# EAGLE design out8_16A_bo (EAGLE 5.04)
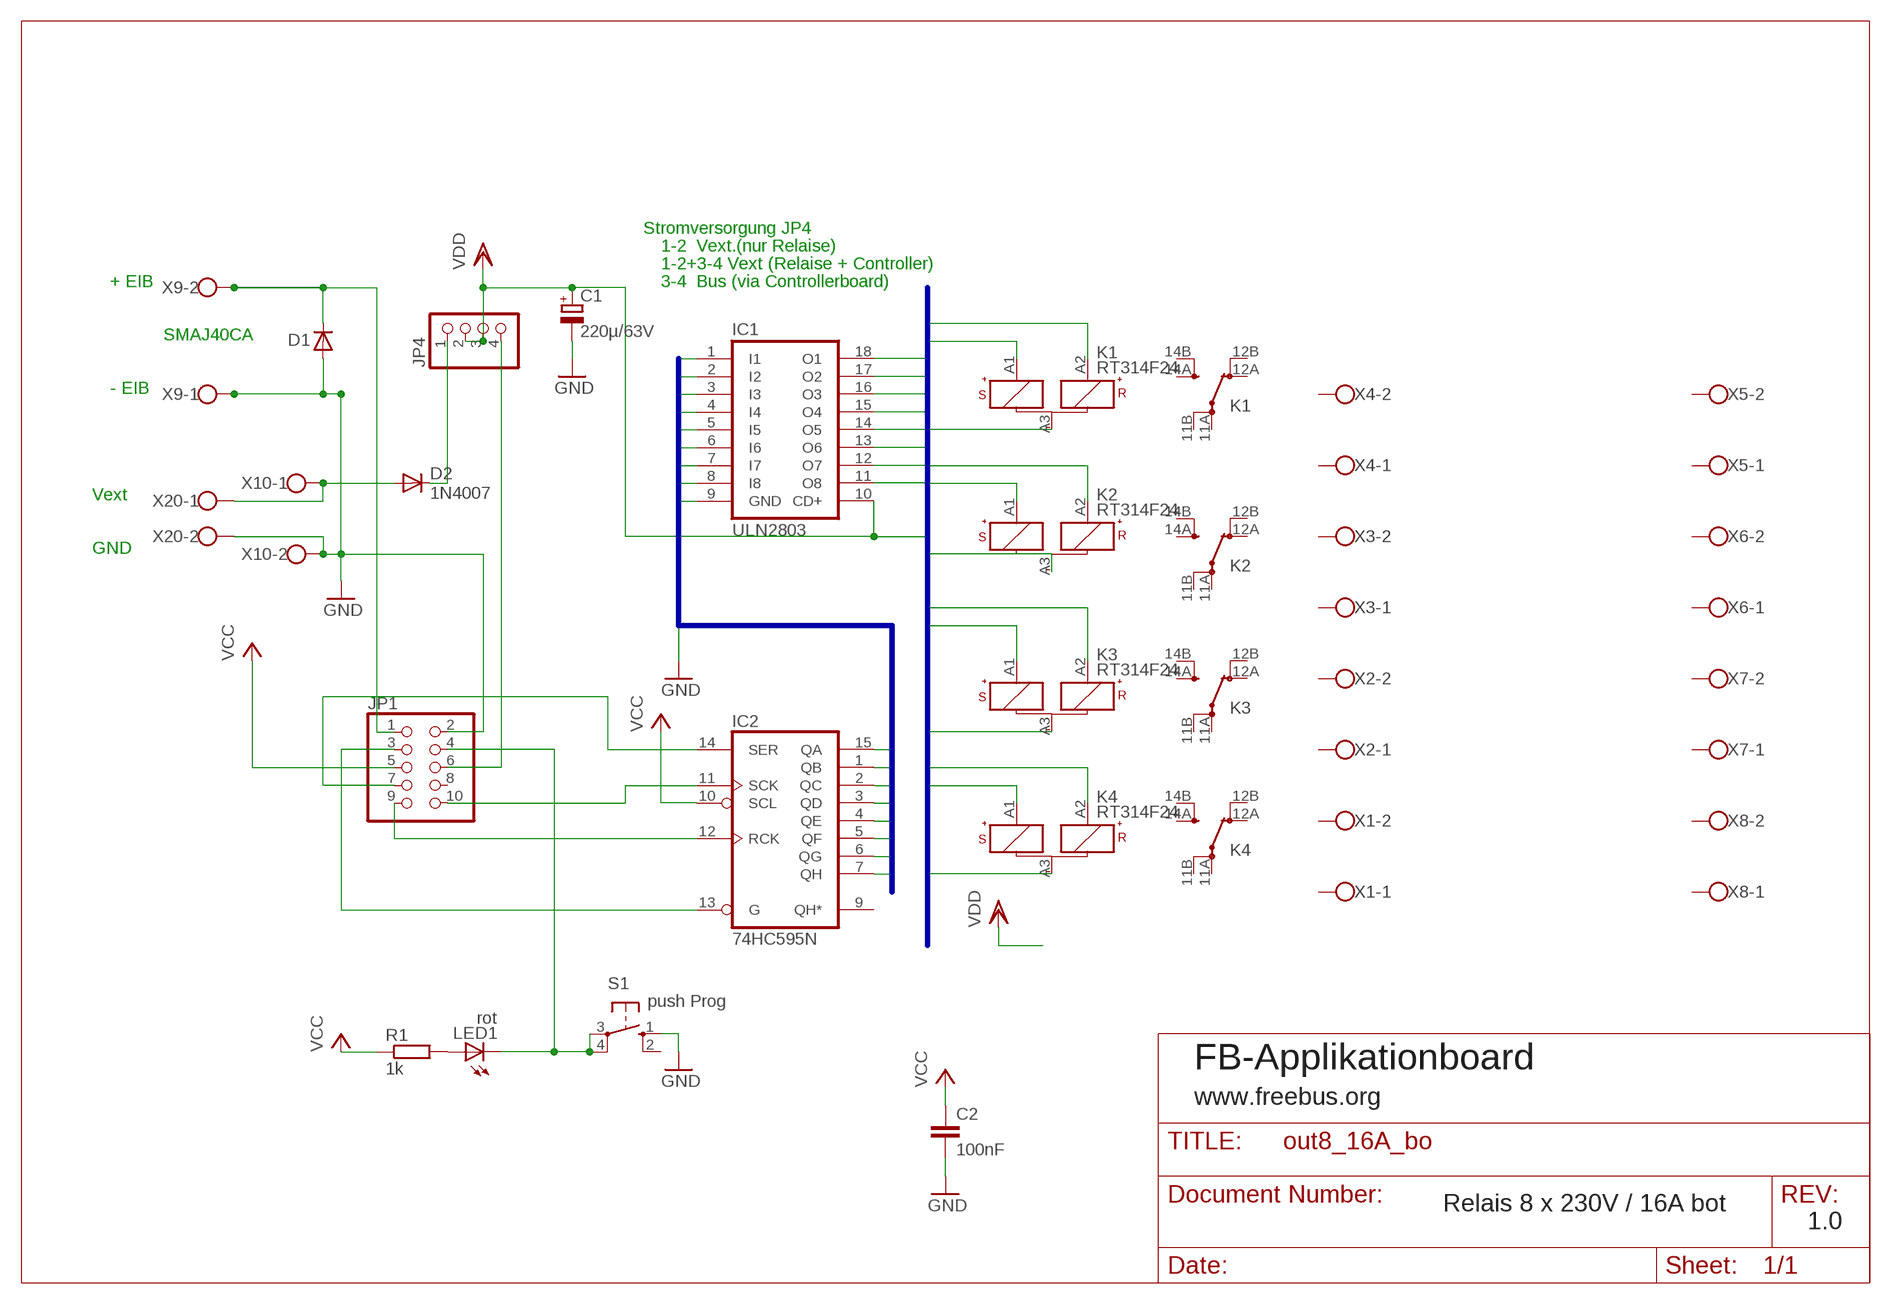
[diagram p0: schematic, sheet 1]

## Parts
C1  220µ/63V  CPOL-EUE5-10.5  [E5-10,5]
C2  100nF  C-EU050-024X044  [C050-024X044]
D1  D-SMB  [SMB]
D2  1N4007  1N4004  [DO41-10]
IC1  ULN2803  ULN2803A  [DIL18]
IC2  74HC595N  [DIL16]
JP1  PINHD-2X5  [2X05]
JP4  PINHD-1X4  [1X04]
K1  RT314F24  [RT1-BI]
K2  RT314F24  [RT1-BI]
K3  RT314F24  [RT1-BI]
K4  RT314F24  [RT1-BI]
LED1  rot  LED3MM  [LED3MM]
R1  1k  R-EU_0207/10  [0207/10]
S1  push Prog  10-XX  [B3F-10XX]
X1  W237-102  [W237-102]
X2  W237-102  [W237-102]
X3  W237-102  [W237-102]
X4  W237-102  [W237-102]
X5  W237-102  [W237-102]
X6  W237-102  [W237-102]
X7  W237-102  [W237-102]
X8  W237-102  [W237-102]
X9  W237-102  [W237-102]
X10  W237-102  [W237-102]
X20  W237-102AKL007-2P  [AKL007-02]

## Nets
GND: C1.- C2.2 D1.2(A) IC1.9(GND) JP1.2 S1.1(S) X9.1 X10.2 X20.2
N$10: IC2.14(SER) JP1.7
N$11: IC2.11(SCK) JP1.10
N$15: IC2.13(G) JP1.3
N$17: D2.A X10.1 X20.1
N$20: D1.1(C) JP1.1 X9.2
N$24: IC2.12(RCK) JP1.9
N$25: D2.C JP4.1
N$27: JP1.4 LED1.K(C) S1.3(P) S1.4(P1)
N$28: LED1.A R1.2
O1: IC1.11(O8) K2.A2(1:R+)
O2: IC1.12(O7) K2.A1(1:S+)
O3: IC1.13(O6) K1.A2(1:R+)
O4: IC1.14(O5) K1.A1(1:S+)
O5: IC1.15(O4) K4.A2(1:R+)
O6: IC1.16(O3) K4.A1(1:S+)
O7: IC1.17(O2) K3.A2(1:R+)
O8: IC1.18(O1) K3.A1(1:S+)
SERPARA1: IC1.8(I8) IC2.15(QA)
SERPARA2: IC1.7(I7) IC2.1(QB)
SERPARA3: IC1.6(I6) IC2.2(QC)
SERPARA4: IC1.5(I5) IC2.3(QD)
SERPARA5: IC1.4(I4) IC2.4(QE)
SERPARA6: IC1.3(I3) IC2.5(QF)
SERPARA7: IC1.2(I2) IC2.6(QG)
SERPARA8: IC1.1(I1) IC2.7(QH)
VCC: C2.1 IC2.10(SCL) JP1.5 R1.1
VDD: C1.+ IC1.10(CD+) JP4.2 JP4.3 K1.A3(1:-) K2.A3(1:-) K3.A3(1:-) K4.A3(1:-)
VERS: JP1.6 JP4.4
Unconnected: IC2.9(QH*) JP1.8 K1.11A(2:PA) K1.11B(2:PB) K1.12A(2:OA) K1.12B(2:OB) K1.14A(2:SA) K1.14B(2:SB) K2.11A(2:PA) K2.11B(2:PB) K2.12A(2:OA) K2.12B(2:OB) K2.14A(2:SA) K2.14B(2:SB) K3.11A(2:PA) K3.11B(2:PB) K3.12A(2:OA) K3.12B(2:OB) K3.14A(2:SA) K3.14B(2:SB) K4.11A(2:PA) K4.11B(2:PB) K4.12A(2:OA) K4.12B(2:OB) K4.14A(2:SA) K4.14B(2:SB) S1.2(S1) X1.1 X1.2 X2.1 X2.2 X3.1 X3.2 X4.1 X4.2 X5.1 X5.2 X6.1 X6.2 X7.1 X7.2 X8.1 X8.2

## Buses
SERPARA[1..8],GND
O[1..8],VDD

## Notes on the sheet
- Stromversorgung JP4
- 1-2  Vext.(nur Relaise)
- 1-2+3-4 Vext (Relaise + Controller)
- + EIB | 3-4  Bus (via Controllerboard)
- SMAJ40CA
- - EIB
- Vext
- GND
- FB-Applikationboard
- www.freebus.org
- Relais 8 x 230V / 16A bot
- 1.0

## Power pins joined to a net without a drawn wire
GND: IC2.8(GND)
VCC: IC2.16(VCC)

## Library data of the parts
C1 = rcl:CPOL-EU: POLARIZED CAPACITOR, European symbol
C2 = rcl:C-EU: CAPACITOR, European symbol
D1 = semicon-smd-ipc:D-: DIODE unfilled
D2 = diode:1N4004: DIODE general purpose rectifier, 1 A
IC1 = uln-udn:ULN2803A: DRIVER ARRAY
IC2 = 74xx-eu:74*595: 8-bit SHIFT REGISTER, output latch
JP1 = pinhead:PINHD-2X5: PIN HEADER
JP4 = pinhead:PINHD-1X4: PIN HEADER
K1-K4 = relay:RT?F*: Power PCB Relay SCHRACK bistable 1 pole 16 A, polarized bistable version Source: http://www.schrack.com/.. 5821.pdf
LED1 = led:LED: LED OSRAM: - CHIPLED LG R971, LG N971, LY N971, LG Q971, LY Q971, LO R971, LY R971 LH N974, LH R974 LS Q976, LO Q976, LY Q976 LO Q996 - Hyper CHIPLED LW Q18S LB Q993, LB Q99A, LB R99A - SideLED LS A670, LO A670, LY A670, LG A670, LP A670 LB A673, LV A673, LT A673, LW A673 LH A674 LY A675 LS A676, LA A676, LO A676, LY A676, LW A676 LS A679, LY A679, LG A679 - Hyper Micro SIDELED® LS Y876, LA Y876, LO Y876, LY Y876 LT Y87S - SmartLED LW L88C, LW L88S LB L89C, LB L89S, LG L890 LS L89K, LO L89K, LY L89K LS L896, LA L896, LO L896, LY L896 - TOPLED LS T670, LO T670, LY T670, LG T670, LP T670 LSG T670, LSP T670, LSY T670, LOP T670, LYG T670 LG T671, LOG T671, LSG T671 LB T673, LV T673, LT T673, LW T673 LH T674 LS T676, LA T676, LO T676, LY T676, LB T676, LH T676, LSB T676, LW T676 LB T67C, LV T67C, LT T67C, LS T67K, LO T67K, LY T67K, LW E67C LS E67B, LA E67B, LO E67B, LY E67B, LB E67C, LV E67C, LT E67C LW T67C LS T679, LY T679, LG T679 LS T770, LO T770, LY T770, LG T770, LP T770 LB T773, LV T773, LT T773, LW T773 LH T774 LS E675, LA E675, LY E675, LS T675 LS T776, LA T776, LO T776, LY T776, LB T776 LHGB T686 LT T68C, LB T68C - Hyper Mini TOPLED® LB M676 - Mini TOPLED Santana® LG M470 LS M47K, LO M47K, LY M47K Source: http://www.osram.convergy.de - LUMILED® LXK2-PW12-R00, LXK2-PW12-S00, LXK2-PW14-U00, LXK2-PW14-V00 LXK2-PM12-R00, LXK2-PM12-S00, LXK2-PM14-U00 LXK2-PE12-Q00, LXK2-PE12-R00, LXK2-PE12-S00, LXK2-PE14-T00, LXK2-PE14-U00 LXK2-PB12-K00, LXK2-PB12-L00, LXK2-PB12-M00, LXK2-PB14-N00, LXK2-PB14-P00, LXK2-PB14-Q00 LXK2-PR12-L00, LXK2-PR12-M00, LXK2-PR14-Q00, LXK2-PR14-R00 LXK2-PD12-Q00, LXK2-PD12-R00, LXK2-PD12-S00 LXK2-PH12-R00, LXK2-PH12-S00 LXK2-PL12-P00, LXK2-PL12-Q00, LXK2-PL12-R00 Source: www.luxeon.com
R1 = rcl:R-EU_: RESISTOR, European symbol
S1 = switch-omron:10-XX: OMRON SWITCH
X1-X10 X20 = con-wago-500:W237-102: WAGO SCREW CLAMP

## Net classes
0 SELV: width 0.406 mm
1 230Vac: width 1.93 mm, clearance 5.08 mm to class 0, clearance 1.905 mm

## Board
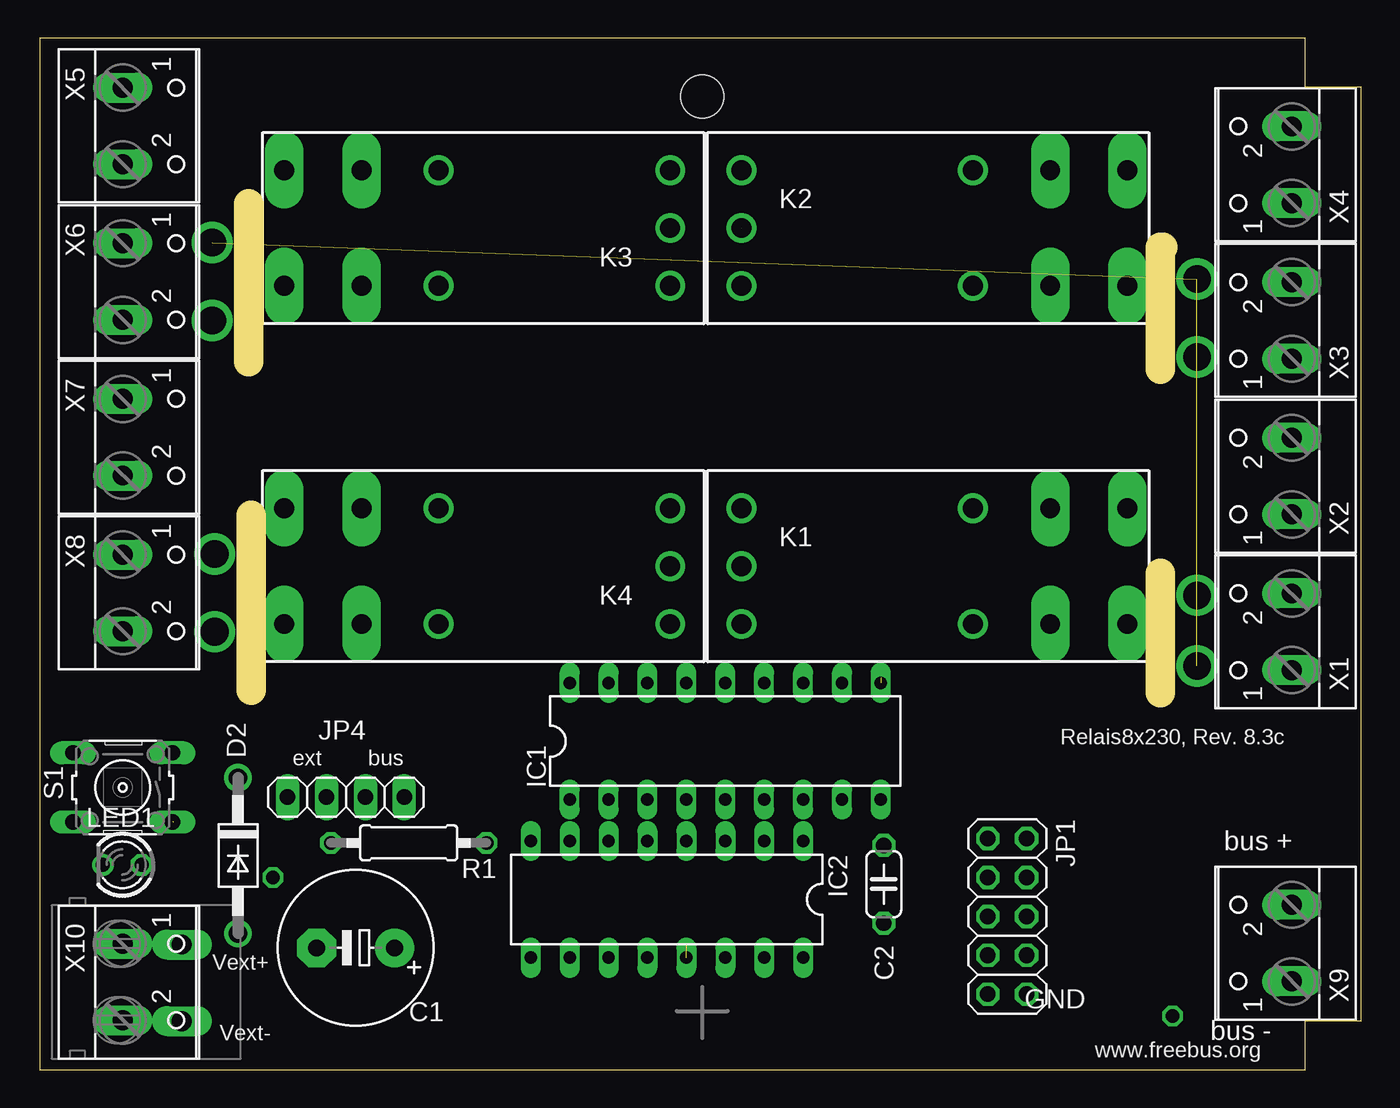
[diagram p1: board, top side]
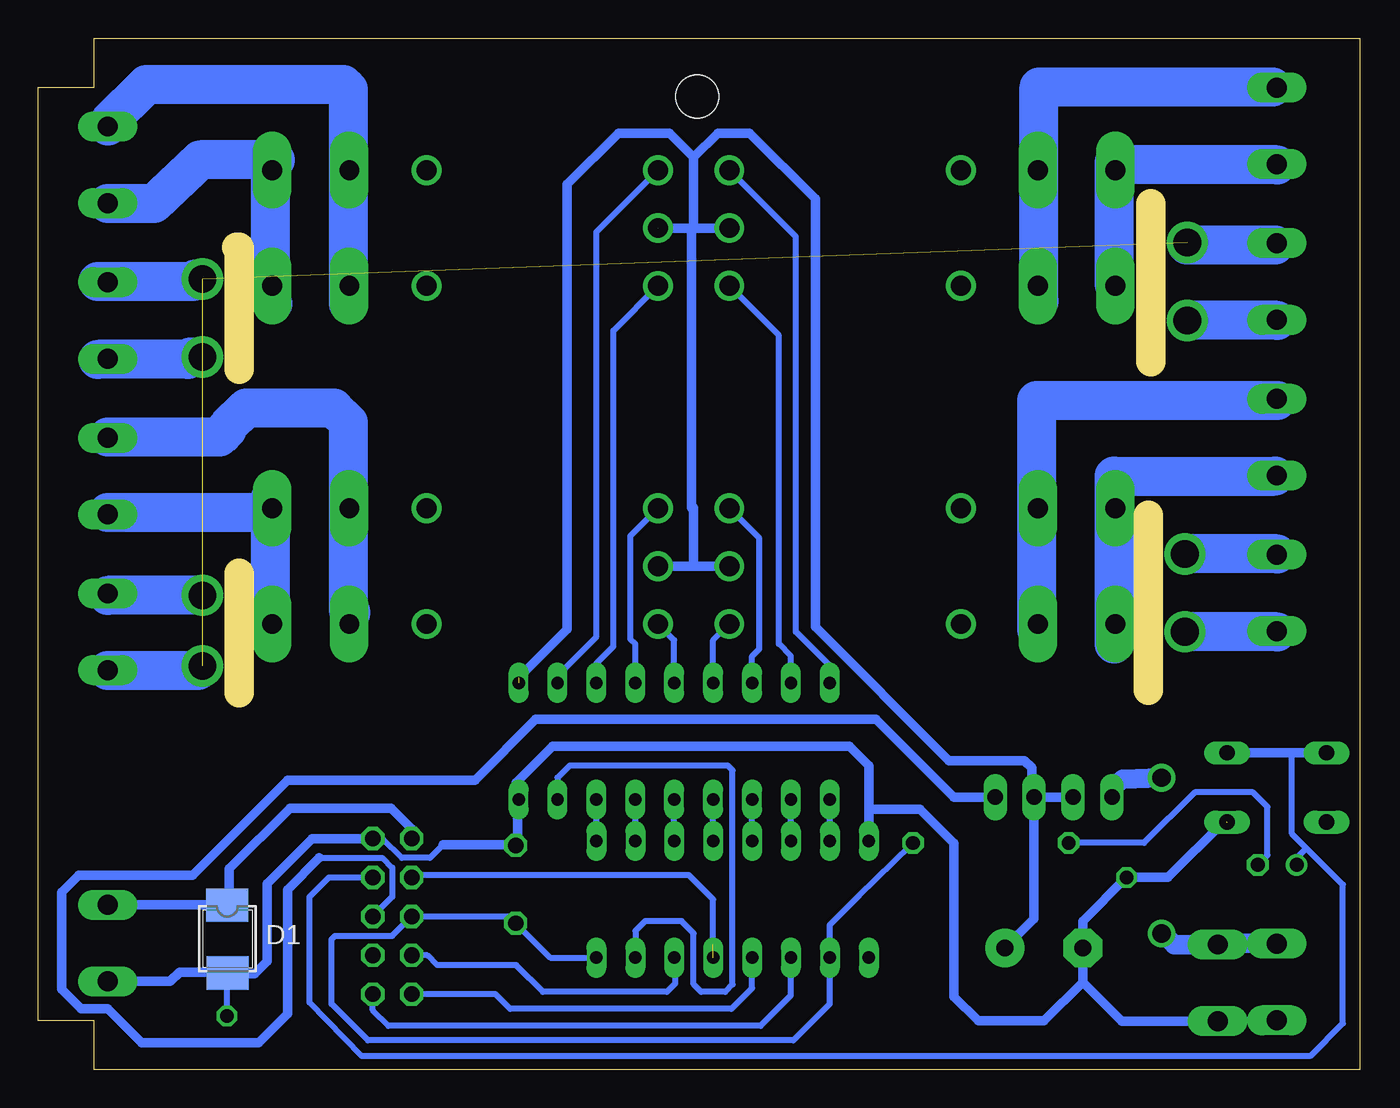
[diagram p2: board, bottom side, seen from below]

Size 86.28 x 67.31 mm. Coordinates in mm from the lower left corner, seen from the top.
Outline: 0,0.01 82.64,0 82.64,3.18 86.28,3.18 86.28,64.13 82.64,64.13 82.64,67.31 0,67.31 0,0.01
Copper layers (1*16): Top 0.035mm / dielectric 1.5mm / Bottom 0.035mm
Design rules "default": minimum track width 10mil, minimum drill 24mil, track to track 16mil, track to pad 12mil, pad to pad 16mil, via to via 16mil, smd to smd 8mil, copper to edge 20mil, drill to drill 10mil, minimum pad ring 10mil, minimum via ring 8mil, stop-mask expansion 4mil, vias tented up to drill 0mil, thermal gap 10mil
Holes 2.8 mm at 43.27,63.5
tKeepout: area 41.1,61.4 to 45.2,65.6; area 14.7,45.5 to 17.7,48.5
Milling: 5 lines

### Footprints (pad centres in the part's own frame; a part is rotated, then mirrored left to right if it is on the bottom)
E5-10,5 = drill 1.1 pad 2.54 round: + -2.54,0 | drill 1.1 pad 2.54 octagon: - 2.54,0
C050-024X044 = drill 1 octagon: 1 -2.54,0; 2 2.54,0
SMB = smd 2.159 x 2.743: 1 -2.311,-0.127; 2 2.108,-0.102
DO41-10 = drill 1.2 round: A 5.08,0; C -5.08,0
DIL18 = drill 0.813 long: 1 -10.16,-3.81; 2 -7.62,-3.81; 3 -5.08,-3.81; 4 -2.54,-3.81; 5 0,-3.81; 6 2.54,-3.81; 7 5.08,-3.81; 8 7.62,-3.81; 9 10.16,-3.81; 10 10.16,3.81; 11 7.62,3.81; 12 5.08,3.81; 13 2.54,3.81; 14 0,3.81; 15 -2.54,3.81; 16 -5.08,3.81; 17 -7.62,3.81; 18 -10.16,3.81
DIL16 = drill 0.813 long: 1 -8.89,-3.81; 2 -6.35,-3.81; 3 -3.81,-3.81; 4 -1.27,-3.81; 5 1.27,-3.81; 6 3.81,-3.81; 7 6.35,-3.81; 8 8.89,-3.81; 9 8.89,3.81; 10 6.35,3.81; 11 3.81,3.81; 12 1.27,3.81; 13 -1.27,3.81; 14 -3.81,3.81; 15 -6.35,3.81; 16 -8.89,3.81
2X05 = drill 1.016 octagon: 1 -5.08,-1.27; 2 -5.08,1.27; 3 -2.54,-1.27; 4 -2.54,1.27; 5 0,-1.27; 6 0,1.27; 7 2.54,-1.27; 8 2.54,1.27; 9 5.08,-1.27; 10 5.08,1.27
1X04 = drill 1.016 long: 1 -3.81,0; 2 -1.27,0; 3 1.27,0; 4 3.81,0
RT1-BI = drill 1.3 pad 2.5 long: 11A 7.56,3.78; 11B 7.56,-3.78; 14A 12.6,3.78; 14B 12.6,-3.78 | drill 1.3 round: 12A 2.52,3.78; 12B 2.52,-3.78; A1 -12.6,-3.78; A2 -12.6,3.78; A3 -12.6,0
LED3MM = drill 0.9 octagon: A -1.27,0 | drill 0.9 round: K 1.27,0
0207/10 = drill 0.9 octagon: 1 -5.08,0; 2 5.08,0
B3F-10XX = drill 1 long: 1 -3.251,2.261; 2 3.251,2.261; 3 -3.251,-2.261; 4 3.251,-2.261
W237-102 = drill 1.3 long: 1 -2.5,-1.27; 2 2.5,-1.27
AKL007-02 = drill 1.3 long: 1 -2.45,2.325; 2 2.55,2.325

### Placement (x,y rotation side)
C1  20.63,7.94 180 top
C2  55.11,12.1 90 top
D1  73.81,8.41 270 bottom
D2  12.95,13.97 270 top
IC1  44.76,21.43 0 top
IC2  40.95,11.11 180 top
JP1  63.18,10 270 top
JP4  20,17.78 0 top
K1  58.41,32.86 0 top
K2  58.41,54.93 0 top
K3  28.57,54.93 180 top
K4  28.57,32.86 180 top
LED1  5.39,13.37 180 top
R1  24.09,14.8 180 top
S1  5.42,18.42 180 top
X1  80.48,28.58 90 top
X2  80.48,38.73 90 top
X3  80.48,48.89 90 top
X4  80.48,59.05 90 top
X5  6.69,61.59 270 top
X6  6.69,51.43 270 top
X7  6.69,41.27 270 top
X8  6.69,31.12 270 top
X9  80.48,8.26 90 top
X10  6.69,5.71 270 top
X20  6.96,5.71 270 top

### Tracks (layer width: path | path; a pad name or v marks a point on that pad's centre or on a via)
GND  (via drill 0.9)  (1 unrouted)
  Bottom 0.406: 9.36,3.17 9.2,3.17 9.16,3.21 X10.2 | 32.06,14.05 IC2.8 | 55,14.84 55,15.4 55.03,15.43 C2.2 55.16,14.68 | 55,17.54 IC1.9 55.08,17.78 | 73.88,6.27 D1.2 | v73.97,3.49 73.97,6.25 D1.2 | D1.2 73.96,6.35 | 59.84,14.68 60.72,13.81 62.54,13.81 63.81,15.08 JP1.2
  Bottom 0.61: 9.36,3.17 9.35,3.17 X20.2 15.54,3.17 18.09,5.71 | 55,17.54 55,15.4 | JP1.2 68.41,15.08 71.35,12.14 71.35,7.06 72.15,6.27 73.88,6.27 | X9.1 77.66,5.75 77.07,6.35 73.96,6.35 | 55.16,14.68 59.84,14.68 | 55.08,17.78 55.08,18.73 52.7,21.11 33.33,21.11 32.06,19.84 32.06,14.05 32.06,16.99 | v15.23,12.54 18.09,9.68 C1.- 18.09,8.41 18.09,5.71 | X10.2 5.38,3.17 | 32.06,16.99 | 32.06,16.99 28.73,16.99 26.5,14.76 26.5,4.76 24.92,3.17 20.63,3.17 18.09,5.71 | 8.73,16.19 8.88,16.19 12.54,12.54 v15.23,12.54 | v15.23,12.54
N$3  (via drill 1.8 pad 2.54)  (4 unrouted)
  Bottom 2.54: 5.55,53.82 11.27,53.82 v11.27,53.98 | 81.75,26.04 75.88,26.04 v75.56,26.35
  other vias: 75.56,51.59 75.56,46.51 75.56,30.96
N$4  (via drill 1.8 pad 2.54)
  Bottom 2.54: 5.39,48.89 v11.27,48.89
N$5  (via drill 1.8 pad 2.54)
  Bottom 2.54: 5.39,33.66 v11.42,33.66 | v11.42,33.66
N$6  (via drill 1.8 pad 2.54)
  Bottom 2.54: 5.39,28.58 v11.42,28.58
N$10
  Bottom 0.406: JP1.7 60.87,7.46 60.24,6.83 55.08,6.83 53.33,5.08 45.24,5.08 44.68,5.64 44.68,7.22 IC2.14
N$11
  Bottom 0.406: JP1.10 64.45,3.89 63.41,2.86 39.13,2.86 37.14,4.84 IC2.11
N$12
  Bottom 2.54: 5.71,64.14 20.95,64.14 20.95,50.16
N$13
  Bottom 2.54: 16.03,51.28 16.03,59.21
N$14
  Bottom 2.54: 5.39,59.05 15.87,59.05 15.87,58.9
N$15  (1 unrouted)
  Bottom 0.406: JP1.3 61.75,12.7 55.4,12.7 43.81,12.7 42.22,11.11 IC2.13 | 42.22,8.18
N$16
  Bottom 2.54: 5.39,43.66 21.11,43.66 21.11,28.73
N$17
  Bottom 0.61: 9.04,8.26 9.13,8.17 X20.1
  Bottom 0.813: 5.39,8.26 X10.1
  Bottom 1.27: 5.39,8.26 9.04,8.26 | D2.A 12.85,8.89 12.13,8.17 X20.1
N$19
  Bottom 2.54: 5.55,38.73 16.03,38.73 16.03,27.78
N$20
  Bottom 0.406: 73.97,10.75 D1.1 73.81,10.85 | JP1.1 61.91,15.72
  Bottom 0.61: 73.97,10.75 X9.2 | 61.91,15.72 63.26,17.07 69.84,17.07 73.81,13.1 73.81,10.85
N$24
  Bottom 0.406: JP1.9 56.43,4.92 55.48,3.97 41.03,3.97 39.68,5.32 IC2.12
N$25
  Bottom 1.27: D2.C 15.49,18.96 16.19,18.42 16.19,18.26 JP4.1
N$27
  Bottom 0.406: JP1.4 67.3,12.54 68.57,11.27 68.57,4.37 65.16,0.87 3.25,0.87 1.1,3.02 1.1,12.06 3.49,14.45 | 3.49,14.45 4.44,15.4 4.44,20.52 4.6,20.68 | S1.3 8.71,20.64 | LED1.K 4.12,13.81 3.49,14.45
  Bottom 0.61: 8.69,20.68 8.73,20.68 8.73,20.64 8.69,20.68 | S1.4 4.6,20.68 S1.3 8.69,20.68
N$28
  Bottom 0.406: R1.2 14.09,14.8 10.79,18.1 6.98,18.1 6.03,17.15 6.03,14 LED1.A
N$29
  Bottom 2.54: 81.75,61.59 81.75,61.75 79.21,64.29 66.35,64.29 66.03,63.98 66.03,50.01
N$30
  Bottom 2.54: 71.11,58.74 71.11,50.16 70.95,50.01
N$31
  Bottom 2.54: 81.75,56.52 78.73,56.52 75.72,59.37 70.8,59.37
N$32
  Bottom 2.54: 75.56,51.59 76.03,51.59 76.19,51.43 82.39,51.43
N$33
  Bottom 2.54: 75.56,46.51 76.35,46.51 76.51,46.35 82.39,46.35
N$34
  Bottom 2.54: 71.11,29.21 71.11,36.35 | 71.11,36.35 71.11,37.31 | 71.11,36.35 81.75,36.35
N$36
  Bottom 2.54: 81.75,41.27 74.45,41.27 73.97,41.75 73.97,41.91 72.7,43.18 66.99,43.18 66.03,42.23 66.03,30 65.88,29.85
N$37
  Bottom 2.54: 75.56,30.96 81.75,30.96
O1
  Bottom 0.406: IC1.11 52.38,25.72 49.84,28.26 49.84,54.68 K2.A2
O2
  Bottom 0.406: IC1.12 49.84,26.51 48.73,27.62 48.73,48.23 K2.A1
O3
  Bottom 0.406: IC1.13 47.3,27.78 47.62,28.1 47.62,34.84 K1.A2
O4
  Bottom 0.406: IC1.14 44.76,28.03 K1.A1
O5
  Bottom 0.406: IC1.15 42.22,28.03 K4.A2
O6
  Bottom 0.406: IC1.16 39.68,26.99 39.2,27.46 39.2,34.68 K4.A1
O7
  Bottom 0.406: IC1.17 37.14,26.99 37.94,27.78 37.94,47.91 K3.A2
O8
  Bottom 0.406: IC1.18 34.6,26.35 36.82,28.58 36.82,54.36 K3.A1
SERPARA1
  Bottom 0.406: IC1.8 52.38,19.05 51.59,19.84 41.27,19.84 40.95,19.53 40.95,5.56 41.43,5.08 43.02,5.08 43.49,5.56 43.49,8.89 44.28,9.68 46.67,9.68 47.3,9.05 IC2.15 | IC2.15
SERPARA2
  Bottom 0.406: IC1.7 | IC2.1 IC1.7
SERPARA3
  Bottom 0.406: IC1.6 | IC2.2 IC1.6
SERPARA4
  Bottom 0.406: IC1.5 | IC2.3 IC1.5
SERPARA5
  Bottom 0.406: IC1.4 | IC2.4 IC1.4
SERPARA6
  Bottom 0.406: IC1.3 | IC2.5 IC1.3
SERPARA7
  Bottom 0.406: IC1.2 | IC2.6 IC1.2
SERPARA8
  Bottom 0.406: IC1.1 | IC2.7 IC1.1
VCC
  Bottom 0.406: R1.1 29.12,14.68 29.28,14.68 32.7,11.35 34.6,9.45 IC2.10 34.6,4.29 36.98,1.91 64.76,1.91 67.14,4.29 67.14,8.49 66.91,8.73 63.18,8.73 JP1.5 55.56,10 C2.1 52.86,7.3 IC2.16 49.76,7.3
VDD  (2 unrouted)
  Bottom 0.61: 43.49,32.86 K1.A3 | 43.49,32.86 K4.A3 | 43.49,32.86 | 54.92,25.56 51.75,28.73 51.75,57.78 48.41,61.12 45.08,61.12 43.49,59.53 | 43.49,32.86 43.49,36.67 43.65,36.67 43.65,54.93 | K3.A3 43.49,54.93 43.49,55.09 | 43.65,54.93 K2.A3 | 43.49,55.09 43.65,54.93 | 43.49,59.53 43.49,55.09 | 43.49,59.53 41.9,61.12 39.84,61.12 35.55,56.83 35.55,28.89 | 35.55,28.89 | 35.55,28.89 26.82,20.16 21.9,20.16 21.42,19.69 21.42,17.94 JP4.3 | JP4.3 JP4.2 | JP4.3 21.27,9.84 C1.+
VERS
  Bottom 0.406: 67.94,13.81 63.81,13.81 63.18,13.18 63.18,11.27 JP1.6
  Bottom 0.61: JP4.4 26.5,17.78 31.58,22.86 53.81,22.86 57.78,18.89 70,18.89 76.19,12.7 83.66,12.7 84.77,11.59 84.77,5.24 83.5,3.97 81.75,3.97 79.53,1.75 71.91,1.75 70,3.65 70,11.75 67.94,13.81

### Text on the board
tPlace: ext | bus | bus + | Vext+ | Vext- | bus -
tNames: Relais8x230, Rev. 8.3c | GND | www.freebus.org
Document: A5 | A4 | A6 | A3 | A7 | A2 | A8 | A1 | EIB + | Vext+ | EIB - | Vext-